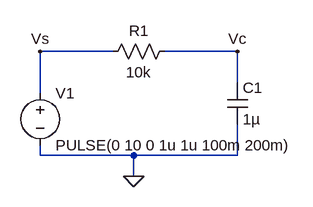
[diagram p0: schematic Draft1.asc]
Draft1.asc, the LTspice schematic file:
Version 4
SHEET 1 880 680
WIRE 240 80 128 80
WIRE 432 80 320 80
WIRE 432 128 432 80
WIRE 128 144 128 80
WIRE 128 240 128 224
WIRE 272 240 128 240
WIRE 432 240 432 192
WIRE 432 240 272 240
WIRE 272 272 272 240
FLAG 272 272 0
FLAG 128 80 Vs
FLAG 432 80 Vc
SYMBOL voltage 128 128 R0
WINDOW 123 0 0 Left 0
WINDOW 39 0 0 Left 0
SYMATTR InstName V1
SYMATTR Value PULSE(0 10 0 1u 1u 100m 200m)
SYMBOL res 336 64 R90
WINDOW 0 0 56 VBottom 2
WINDOW 3 32 56 VTop 2
SYMATTR InstName R1
SYMATTR Value 10k
SYMBOL cap 416 128 R0
SYMATTR InstName C1
SYMATTR Value 1µ

The netlist it stands for:
* Draft1.asc
V1 Vs 0 PULSE(0 10 0 1u 1u 100m 200m)
R1 Vc Vs 10k
C1 Vc 0 1µ
.backanno
.end